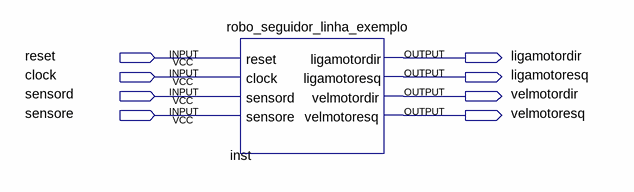
[diagram p0: schematic sheet]
// Quartus schematic Block1.bdf as structural Verilog: 1 symbols, 8 pins
module Block1 (
  input  reset,
  input  clock,
  input  sensord,
  input  sensore,
  output ligamotordir,
  output ligamotoresq,
  output velmotordir,
  output velmotoresq
);

  robo_seguidor_linha_exemplo inst (
    .reset(reset), .clock(clock), .sensord(sensord), .sensore(sensore), .ligamotordir(ligamotordir),
    .ligamotoresq(ligamotoresq), .velmotordir(velmotordir), .velmotoresq(velmotoresq));
endmodule
